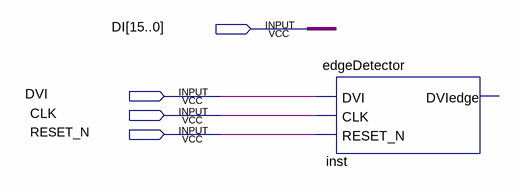
[diagram p0: schematic sheet]
// Quartus schematic codecToFFT.bdf as structural Verilog: 1 symbols, 4 pins
module codecToFFT (
  input  [15:0] DI,
  input  DVI,
  input  CLK,
  input  RESET_N
);

  edgeDetector inst (.DVI(DVI), .CLK(CLK), .RESET_N(RESET_N));  // open: DVIedge
endmodule
